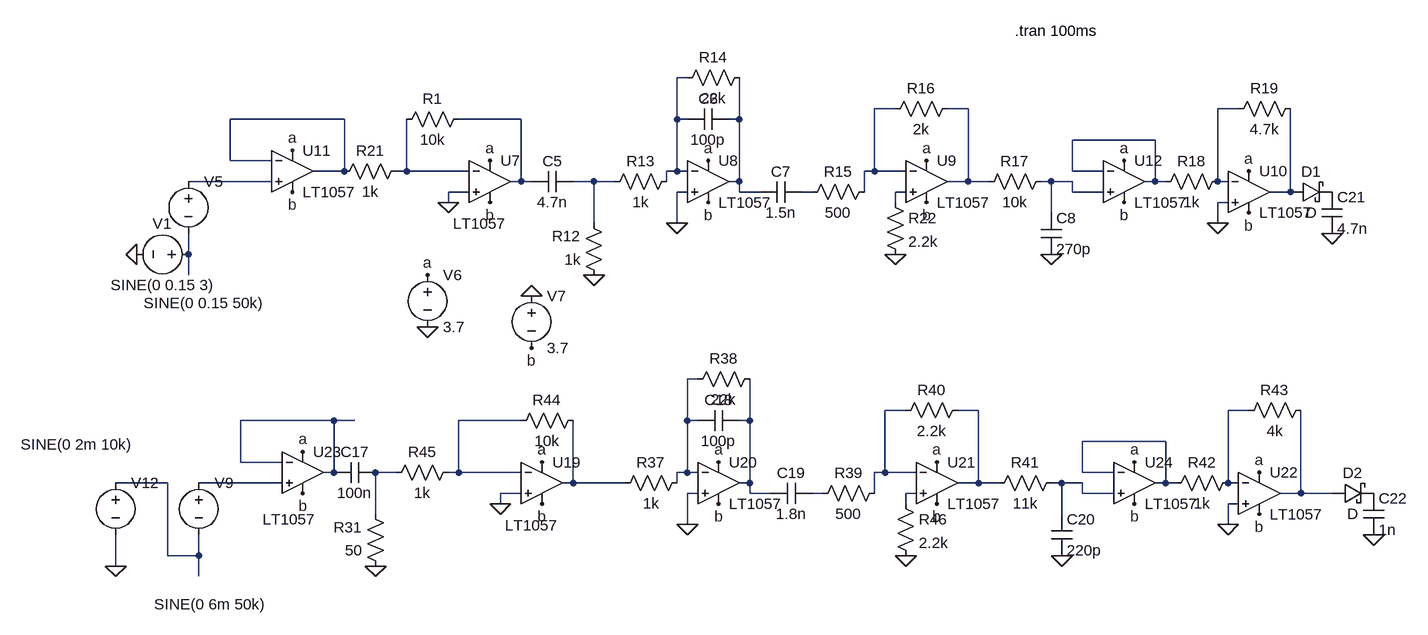
[diagram p0: schematic Idea Filtrado.asc]
Idea Filtrado.asc, the LTspice schematic file:
Version 4
SHEET 1 1448 2024
WIRE 288 688 272 688
WIRE 608 736 576 736
WIRE 720 736 688 736
WIRE 1136 736 1104 736
WIRE -240 752 -416 752
WIRE 32 752 -64 752
WIRE 272 752 272 688
WIRE 288 752 272 752
WIRE 368 752 368 688
WIRE 368 752 352 752
WIRE 1008 784 880 784
WIRE -416 816 -416 752
WIRE -352 816 -416 816
WIRE -240 832 -240 752
WIRE -240 832 -288 832
WIRE -144 832 -144 752
WIRE -144 832 -160 832
WIRE -48 832 -144 832
WIRE 272 832 272 752
WIRE 272 832 256 832
WIRE 288 832 272 832
WIRE 576 832 576 736
WIRE 576 832 560 832
WIRE 624 832 576 832
WIRE 880 832 880 784
WIRE 928 832 880 832
WIRE -352 848 -480 848
WIRE 32 848 32 752
WIRE 32 848 16 848
WIRE 48 848 32 848
WIRE 144 848 112 848
WIRE 176 848 144 848
WIRE 256 848 256 832
WIRE 368 848 368 752
WIRE 368 848 352 848
WIRE 720 848 720 736
WIRE 720 848 688 848
WIRE 752 848 720 848
WIRE 848 848 832 848
WIRE 880 848 848 848
WIRE 1008 848 1008 784
WIRE 1008 848 992 848
WIRE 1024 848 1008 848
WIRE 1104 848 1104 736
WIRE 1120 848 1104 848
WIRE -48 864 -80 864
WIRE 288 864 272 864
WIRE 368 864 368 848
WIRE 400 864 368 864
WIRE 480 864 464 864
WIRE 560 864 560 832
WIRE 624 864 608 864
WIRE 880 864 880 848
WIRE 928 864 880 864
WIRE 1216 864 1216 736
WIRE 1216 864 1184 864
WIRE -80 880 -80 864
WIRE 608 880 608 864
WIRE 1120 880 1104 880
WIRE 848 896 848 848
WIRE 144 912 144 848
WIRE 272 912 272 864
WIRE 1104 912 1104 880
WIRE -480 960 -480 928
WIRE -480 992 -480 960
WIRE 304 1152 288 1152
WIRE 624 1200 592 1200
WIRE 736 1200 704 1200
WIRE 1152 1200 1120 1200
WIRE -256 1216 -400 1216
WIRE -224 1216 -256 1216
WIRE 32 1216 -64 1216
WIRE 288 1216 288 1152
WIRE 304 1216 288 1216
WIRE 384 1216 384 1152
WIRE 384 1216 368 1216
WIRE 1024 1248 896 1248
WIRE -400 1280 -400 1216
WIRE -336 1280 -400 1280
WIRE -256 1296 -256 1216
WIRE -256 1296 -272 1296
WIRE -160 1296 -192 1296
WIRE -64 1296 -64 1216
WIRE -64 1296 -80 1296
WIRE 32 1296 -64 1296
WIRE 288 1296 288 1216
WIRE 288 1296 272 1296
WIRE 304 1296 288 1296
WIRE 592 1296 592 1200
WIRE 592 1296 576 1296
WIRE 640 1296 592 1296
WIRE 896 1296 896 1248
WIRE 944 1296 896 1296
WIRE -512 1312 -592 1312
WIRE -336 1312 -464 1312
WIRE 112 1312 112 1216
WIRE 112 1312 96 1312
WIRE 192 1312 112 1312
WIRE 272 1312 272 1296
WIRE 384 1312 384 1216
WIRE 384 1312 368 1312
WIRE 736 1312 736 1200
WIRE 736 1312 704 1312
WIRE 768 1312 736 1312
WIRE 864 1312 848 1312
WIRE 896 1312 864 1312
WIRE 1024 1312 1024 1248
WIRE 1024 1312 1008 1312
WIRE 1040 1312 1024 1312
WIRE 1120 1312 1120 1200
WIRE 1136 1312 1120 1312
WIRE 32 1328 0 1328
WIRE 304 1328 288 1328
WIRE 384 1328 384 1312
WIRE 416 1328 384 1328
WIRE 496 1328 480 1328
WIRE 576 1328 576 1296
WIRE 640 1328 624 1328
WIRE 896 1328 896 1312
WIRE 944 1328 896 1328
WIRE 1232 1328 1232 1200
WIRE 1232 1328 1200 1328
WIRE 1280 1328 1232 1328
WIRE 0 1344 0 1328
WIRE 624 1344 624 1328
WIRE 1136 1344 1120 1344
WIRE -192 1360 -192 1296
WIRE 864 1360 864 1312
WIRE 288 1376 288 1328
WIRE 1120 1376 1120 1344
WIRE -512 1424 -512 1312
WIRE -464 1424 -464 1392
WIRE -464 1424 -512 1424
WIRE -592 1440 -592 1392
WIRE -464 1456 -464 1424
FLAG 144 992 0
FLAG 1104 912 0
FLAG 848 960 0
FLAG 272 912 0
FLAG -112 1072 0
FLAG 48 1024 0
FLAG -112 992 a
FLAG 320 816 a
FLAG -16 816 a
FLAG 656 816 a
FLAG 1152 832 a
FLAG 48 1104 b
FLAG -16 880 b
FLAG 320 880 b
FLAG 656 880 b
FLAG 1152 896 b
FLAG -80 880 0
FLAG -320 800 a
FLAG -320 864 b
FLAG 960 816 a
FLAG 960 880 b
FLAG 608 960 0
FLAG 1120 1376 0
FLAG 864 1424 0
FLAG 288 1376 0
FLAG 336 1280 a
FLAG 64 1280 a
FLAG 672 1280 a
FLAG 1168 1296 a
FLAG 64 1344 b
FLAG 336 1344 b
FLAG 672 1344 b
FLAG 1168 1360 b
FLAG 0 1344 0
FLAG -304 1264 a
FLAG -304 1328 b
FLAG 976 1280 a
FLAG 976 1344 b
FLAG -592 1440 0
FLAG 624 1424 0
FLAG -192 1440 0
FLAG 1280 928 0
FLAG 1344 1392 0
FLAG -560 960 0
SYMBOL Res 160 1008 R180
WINDOW 0 36 76 Left 2
WINDOW 3 36 40 Left 2
SYMATTR InstName R12
SYMATTR Value 1k
SYMBOL Res 160 864 R270
WINDOW 0 32 56 VTop 2
WINDOW 3 0 56 VBottom 2
SYMATTR InstName R13
SYMATTR Value 1k
SYMBOL Res 272 704 R270
WINDOW 0 32 56 VTop 2
WINDOW 3 0 56 VBottom 2
SYMATTR InstName R14
SYMATTR Value 22k
SYMBOL Res 464 880 R270
WINDOW 0 32 56 VTop 2
WINDOW 3 0 56 VBottom 2
SYMATTR InstName R15
SYMATTR Value 500
SYMBOL Res 592 752 R270
WINDOW 0 32 56 VTop 2
WINDOW 3 0 56 VBottom 2
SYMATTR InstName R16
SYMATTR Value 2k
SYMBOL Res 736 864 R270
WINDOW 0 32 56 VTop 2
WINDOW 3 0 56 VBottom 2
SYMATTR InstName R17
SYMATTR Value 10k
SYMBOL Res 1008 864 R270
WINDOW 0 32 56 VTop 2
WINDOW 3 0 56 VBottom 2
SYMATTR InstName R18
SYMATTR Value 1k
SYMBOL Res 1120 752 R270
WINDOW 0 32 56 VTop 2
WINDOW 3 0 56 VBottom 2
SYMATTR InstName R19
SYMATTR Value 4.7k
SYMBOL Cap 48 864 R270
WINDOW 0 32 32 VTop 2
WINDOW 3 0 32 VBottom 2
SYMATTR InstName C5
SYMATTR Value 4.7n
SYMBOL Cap 288 768 R270
WINDOW 0 32 32 VTop 2
WINDOW 3 0 32 VBottom 2
SYMATTR InstName C6
SYMATTR Value 100p
SYMBOL Cap 400 880 R270
WINDOW 0 32 32 VTop 2
WINDOW 3 0 32 VBottom 2
SYMATTR InstName C7
SYMATTR Value 1.5n
SYMBOL Cap 832 896 R0
SYMATTR InstName C8
SYMATTR Value 270p
SYMBOL Voltage -480 832 R0
WINDOW 3 -69 203 Left 2
SYMATTR Value SINE(0 0.15 50k)
SYMATTR InstName V5
SYMBOL Voltage -112 976 R0
SYMATTR InstName V6
SYMATTR Value 3.7
SYMBOL Voltage 48 1008 R0
SYMATTR InstName V7
SYMATTR Value 3.7
SYMBOL Res -144 816 R90
WINDOW 0 0 56 VBottom 2
WINDOW 3 32 56 VTop 2
SYMATTR InstName R21
SYMATTR Value 1k
SYMBOL OpAmps/LT1057 -16 784 R0
WINDOW 3 -57 129 Left 2
SYMATTR InstName U7
SYMBOL OpAmps/LT1057 320 784 R0
SYMATTR InstName U8
SYMBOL OpAmps/LT1057 656 784 R0
SYMATTR InstName U9
SYMBOL OpAmps/LT1057 1152 800 R0
SYMATTR InstName U10
SYMBOL OpAmps/LT1057 -320 768 R0
SYMATTR InstName U11
SYMBOL OpAmps/LT1057 960 784 R0
SYMATTR InstName U12
SYMBOL Res 592 864 R0
SYMATTR InstName R22
SYMATTR Value 2.2k
SYMBOL Res 176 1328 R270
WINDOW 0 32 56 VTop 2
WINDOW 3 0 56 VBottom 2
SYMATTR InstName R37
SYMATTR Value 1k
SYMBOL Res 288 1168 R270
WINDOW 0 32 56 VTop 2
WINDOW 3 0 56 VBottom 2
SYMATTR InstName R38
SYMATTR Value 22k
SYMBOL Res 480 1344 R270
WINDOW 0 32 56 VTop 2
WINDOW 3 0 56 VBottom 2
SYMATTR InstName R39
SYMATTR Value 500
SYMBOL Res 608 1216 R270
WINDOW 0 32 56 VTop 2
WINDOW 3 0 56 VBottom 2
SYMATTR InstName R40
SYMATTR Value 2.2k
SYMBOL Res 752 1328 R270
WINDOW 0 32 56 VTop 2
WINDOW 3 0 56 VBottom 2
SYMATTR InstName R41
SYMATTR Value 11k
SYMBOL Res 1024 1328 R270
WINDOW 0 32 56 VTop 2
WINDOW 3 0 56 VBottom 2
SYMATTR InstName R42
SYMATTR Value 1k
SYMBOL Res 1136 1216 R270
WINDOW 0 32 56 VTop 2
WINDOW 3 0 56 VBottom 2
SYMATTR InstName R43
SYMATTR Value 4k
SYMBOL Cap 304 1232 R270
WINDOW 0 32 32 VTop 2
WINDOW 3 0 32 VBottom 2
SYMATTR InstName C18
SYMATTR Value 100p
SYMBOL Cap 416 1344 R270
WINDOW 0 32 32 VTop 2
WINDOW 3 0 32 VBottom 2
SYMATTR InstName C19
SYMATTR Value 1.8n
SYMBOL Cap 848 1360 R0
SYMATTR InstName C20
SYMATTR Value 220p
SYMBOL Voltage -464 1296 R0
WINDOW 3 -69 203 Left 2
SYMATTR Value SINE(0 6m 50k)
SYMATTR InstName V9
SYMBOL Res 128 1200 R90
WINDOW 0 0 56 VBottom 2
WINDOW 3 32 56 VTop 2
SYMATTR InstName R44
SYMATTR Value 10k
SYMBOL Res -64 1280 R90
WINDOW 0 0 56 VBottom 2
WINDOW 3 32 56 VTop 2
SYMATTR InstName R45
SYMATTR Value 1k
SYMBOL OpAmps/LT1057 64 1248 R0
WINDOW 3 -57 129 Left 2
SYMATTR InstName U19
SYMBOL OpAmps/LT1057 336 1248 R0
SYMATTR InstName U20
SYMBOL OpAmps/LT1057 672 1248 R0
SYMATTR InstName U21
SYMBOL OpAmps/LT1057 1168 1264 R0
SYMATTR InstName U22
SYMBOL OpAmps/LT1057 -304 1232 R0
WINDOW 3 -62 136 Left 2
SYMATTR InstName U23
SYMBOL OpAmps/LT1057 976 1248 R0
SYMATTR InstName U24
SYMBOL Voltage -592 1296 R0
WINDOW 3 -146 -43 Left 2
SYMATTR Value SINE(0 2m 10k)
SYMATTR InstName V12
SYMBOL Res 608 1328 R0
SYMATTR InstName R46
SYMATTR Value 2.2k
SYMBOL Res -176 1456 R180
WINDOW 0 36 76 Left 2
WINDOW 3 36 40 Left 2
SYMATTR InstName R31
SYMATTR Value 50
SYMBOL Cap -192 1280 R90
WINDOW 0 0 32 VBottom 2
WINDOW 3 32 32 VTop 2
SYMATTR InstName C17
SYMATTR Value 100n
SYMBOL schottky 1216 880 R270
WINDOW 0 32 32 VTop 2
WINDOW 3 0 32 VBottom 2
SYMATTR InstName D1
SYMBOL Cap 1264 864 R0
SYMATTR InstName C21
SYMATTR Value 4.7n
SYMBOL Cap 1328 1328 R0
SYMATTR InstName C22
SYMATTR Value 1n
SYMBOL schottky 1280 1344 R270
WINDOW 0 32 32 VTop 2
WINDOW 3 0 32 VBottom 2
SYMATTR InstName D2
SYMBOL Res -48 736 R90
WINDOW 0 0 56 VBottom 2
WINDOW 3 32 56 VTop 2
SYMATTR InstName R1
SYMATTR Value 10k
SYMBOL Voltage -464 960 R90
WINDOW 0 -32 56 VBottom 2
WINDOW 3 32 56 VTop 2
SYMATTR InstName V1
SYMATTR Value SINE(0 0.15 3)
TEXT 792 616 Left 2 !.tran 100ms

The netlist it stands for:
* Idea Filtrado.asc
R12 0 N011 1k
R13 N011 N001 1k
R14 N001 N007 22k
R15 N013 N002 500
R16 N002 N003 2k
R17 N003 N012 10k
R18 N008 N004 1k
R19 N004 N015 4.7k
C5 N006 N011 4.7n
C6 N001 N007 100p
C7 N007 N013 1.5n
C8 N012 0 270p
V5 N010 N016 SINE(0 0.15 50k)
V6 a 0 3.7
V7 0 b 3.7
R21 N009 N005 1k
XU7 0 N009 a b N006 LT1057  ; pins In+ In- V+ V- OUT
XU8 0 N001 a b N007 LT1057  ; pins In+ In- V+ V- OUT
XU9 N014 N002 a b N003 LT1057  ; pins In+ In- V+ V- OUT
XU10 0 N004 a b N015 LT1057  ; pins In+ In- V+ V- OUT
XU11 N010 N005 a b N005 LT1057  ; pins In+ In- V+ V- OUT
XU12 N012 N008 a b N008 LT1057  ; pins In+ In- V+ V- OUT
R22 N014 0 2.2k
R37 N028 N017 1k
R38 N017 N023 22k
R39 N030 N018 500
R40 N018 N019 2.2k
R41 N019 N029 11k
R42 N024 N020 1k
R43 N020 N032 4k
C18 N017 N023 100p
C19 N023 N030 1.8n
C20 N029 0 220p
V9 N027 N026 SINE(0 6m 50k)
R44 N028 N022 10k
R45 N022 N025 1k
XU19 0 N022 a b N028 LT1057  ; pins In+ In- V+ V- OUT
XU20 0 N017 a b N023 LT1057  ; pins In+ In- V+ V- OUT
XU21 N031 N018 a b N019 LT1057  ; pins In+ In- V+ V- OUT
XU22 0 N020 a b N032 LT1057  ; pins In+ In- V+ V- OUT
XU23 N027 N021 a b N021 LT1057  ; pins In+ In- V+ V- OUT
XU24 N029 N024 a b N024 LT1057  ; pins In+ In- V+ V- OUT
V12 N026 0 SINE(0 2m 10k)
R46 N031 0 2.2k
R31 0 N025 50
C17 N025 N021 100n
D1 N015 P001 D
C21 P001 0 4.7n
C22 P002 0 1n
D2 N032 P002 D
R1 N006 N009 10k
V1 N016 0 SINE(0 0.15 3)
.model D D
.lib standard.dio
.tran 100ms
.lib LTC.lib
.backanno
.end